# Altium schematic sheet Sampling.SchDoc
size A4
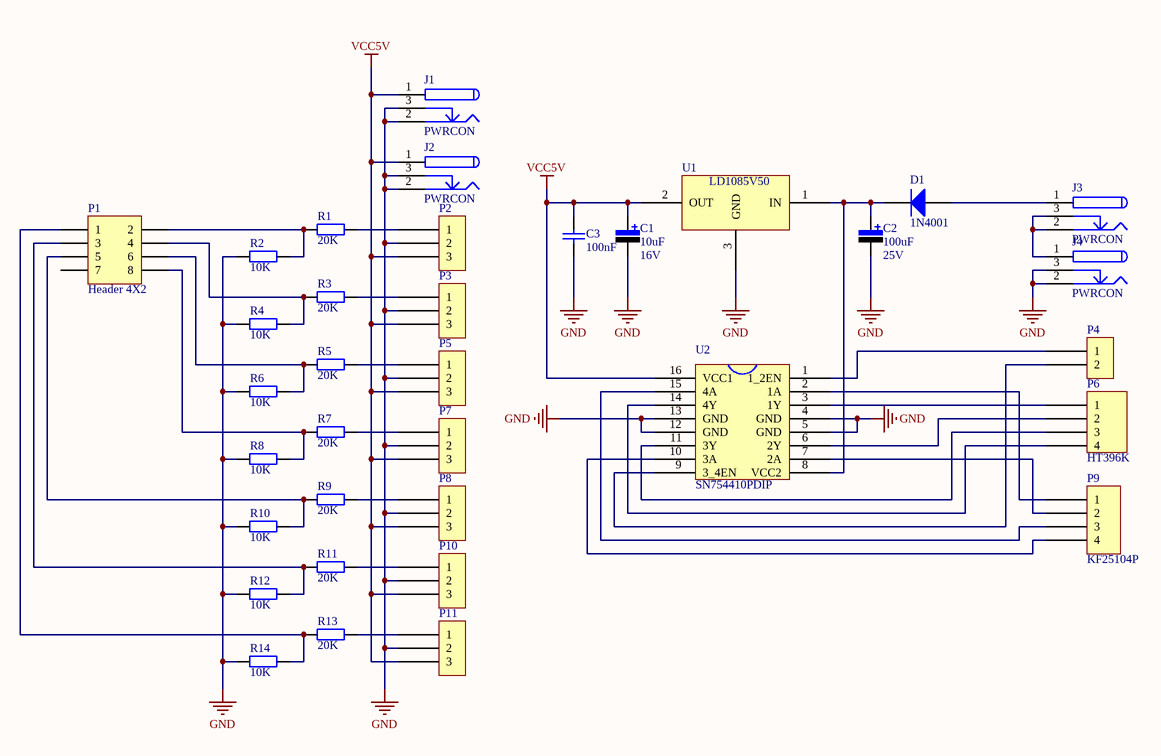
[diagram p0: Sampling.SchDoc]

## Parts
C1  value 10uF  Vol: 16V  [C-RB-S4]  (hidden comment: Cap Pol)
C2  value 100uF  Vol: 25V  [C-RB-S6]  (hidden comment: Cap Pol)
C3  value 100nF  [C-RAD-0805]  (hidden comment: Cap)
D1  Type: 1N4001  [DIODE-SMA]  (hidden comment: Diode)
J1  PWRCON  [DC-005]
J2  PWRCON  [DC-005]
J3  PWRCON  [DC-005]
J4  PWRCON  [DC-005]
P1  Header 4X2  [HDR2X4]
P2  KF25103P  [KF25103P]  (value not drawn)
P3  KF25103P  [KF25103P]  (value not drawn)
P4  KF25102P  [KF25102P]  (value not drawn)
P5  KF25103P  [KF25103P]  (value not drawn)
P6  HT396K  [HT396K]
P7  KF25103P  [KF25103P]  (value not drawn)
P8  KF25103P  [KF25103P]  (value not drawn)
P9  KF25104P  [KF25104P]
P10  KF25103P  [KF25103P]  (value not drawn)
P11  KF25103P  [KF25103P]  (value not drawn)
R1  value 20K  [0805-1]  (hidden comment: Res1)
R2  value 10K  [0805-1]  (hidden comment: Res1)
R3  value 20K  [0805-1]  (hidden comment: Res1)
R4  value 10K  [0805-1]  (hidden comment: Res1)
R5  value 20K  [0805-1]  (hidden comment: Res1)
R6  value 10K  [0805-1]  (hidden comment: Res1)
R7  value 20K  [0805-1]  (hidden comment: Res1)
R8  value 10K  [0805-1]  (hidden comment: Res1)
R9  value 20K  [0805-1]  (hidden comment: Res1)
R10  value 10K  [0805-1]  (hidden comment: Res1)
R11  value 20K  [0805-1]  (hidden comment: Res1)
R12  value 10K  [0805-1]  (hidden comment: Res1)
R13  value 20K  [0805-1]  (hidden comment: Res1)
R14  value 10K  [0805-1]  (hidden comment: Res1)
U1  LD1085V50  [TO-220-AB]
U2  SN754410PDIP  [DIP-16]

## Nets
GND: C1.2 C2.2 C3.1 J1.2 J1.3 J2.2 J2.3 J4.2 J4.3 P2.2 P3.2 P5.2 P7.2 P8.2 P10.2 P11.2 R2.1 R4.1 R6.1 R8.1 R10.1 R12.1 R14.1 U1.3(GND) U2.4(GND) U2.5(GND) U2.12(GND) U2.13(GND)
VCC5V: C1.1 C3.2 J1.1 J2.1 P2.3 P3.3 P5.3 P7.3 P8.3 P10.3 P11.3 U1.2(OUT) U2.16(VCC1)
NetC2_1: C2.1 D1.2(K) U1.1(IN) U2.8(VCC2)
NetD1_1: D1.1(A) J3.1
NetJ3_2: J3.2 J3.3 J4.1
NetP1_1: P1.1 R13.1 R14.2
NetP1_2: P1.2 R1.1 R2.2
NetP1_3: P1.3 R11.1 R12.2
NetP1_4: P1.4 R3.1 R4.2
NetP1_5: P1.5 R9.1 R10.2
NetP1_6: P1.6 R5.1 R6.2
NetP1_8: P1.8 R7.1 R8.2
NetP2_1: P2.1 R1.2
NetP3_1: P3.1 R3.2
NetP4_1: P4.1 U2.1(1_2EN)
NetP4_2: P4.2 U2.9(3_4EN)
NetP5_1: P5.1 R5.2
NetP6_1: P6.1 U2.3(1Y)
NetP6_2: P6.2 U2.6(2Y)
NetP6_3: P6.3 U2.11(3Y)
NetP6_4: P6.4 U2.14(4Y)
NetP7_1: P7.1 R7.2
NetP8_1: P8.1 R9.2
NetP9_1: P9.1 U2.2(1A)
NetP9_2: P9.2 U2.7(2A)
NetP9_3: P9.3 U2.15(4A)
NetP9_4: P9.4 U2.10(3A)
NetP10_1: P10.1 R11.2
NetP11_1: P11.1 R13.2

Not connected (* = marked no-connect by the designer): P1 7

## Library data of the parts
C1 C2 = Cap Pol: 极性电解电容; Published: 8-Jun-2000; LatestRevisionDate: 17-Jul-2002; LatestRevisionNote: Re-released for DXP Platform.; PackageReference: RB7.6-15; Publisher: Altium Limited
C3 = Cap: 无极性电容; Published: 8-Jun-2000; LatestRevisionDate: 17-Jul-2002; LatestRevisionNote: Re-released for DXP Platform.; PackageReference: RAD-0.3; Publisher: Altium Limited
D1 = Diode: 二极管; Published: 8-Jun-2000; LatestRevisionDate: 17-Jul-2002; LatestRevisionNote: Re-released for DXP Platform.; PackageDocument: Sep-1996; PackageReference: SMC; Publisher: Altium Limited; Code_JEDEC: DO-214-AB
J1-J4 = PWRCON: 直流电源端子; Published: 17-Dec-2003; DatasheetDocument: 09-May-2002; Publisher: Altium Limited; ComponentLink1Description: Manufacturer Link; ComponentLink1URL: http://domino.kycon.com/internet/Products.html
P1 = Header 4X2: Header, 4-Pin, Dual row; LatestRevisionDate: 17-Jul-2002; LatestRevisionNote: Re-released for DXP Platform.; Publisher: Altium Limited
R1-R14 = Res1: 贴片电阻; Published: 8-Jun-2000; LatestRevisionDate: 17-Jul-2002; LatestRevisionNote: Re-released for DXP Platform.; PackageReference: AXIAL-0.4; Publisher: Altium Limited